# Altium schematic sheet Connectors.SchDoc
size A3
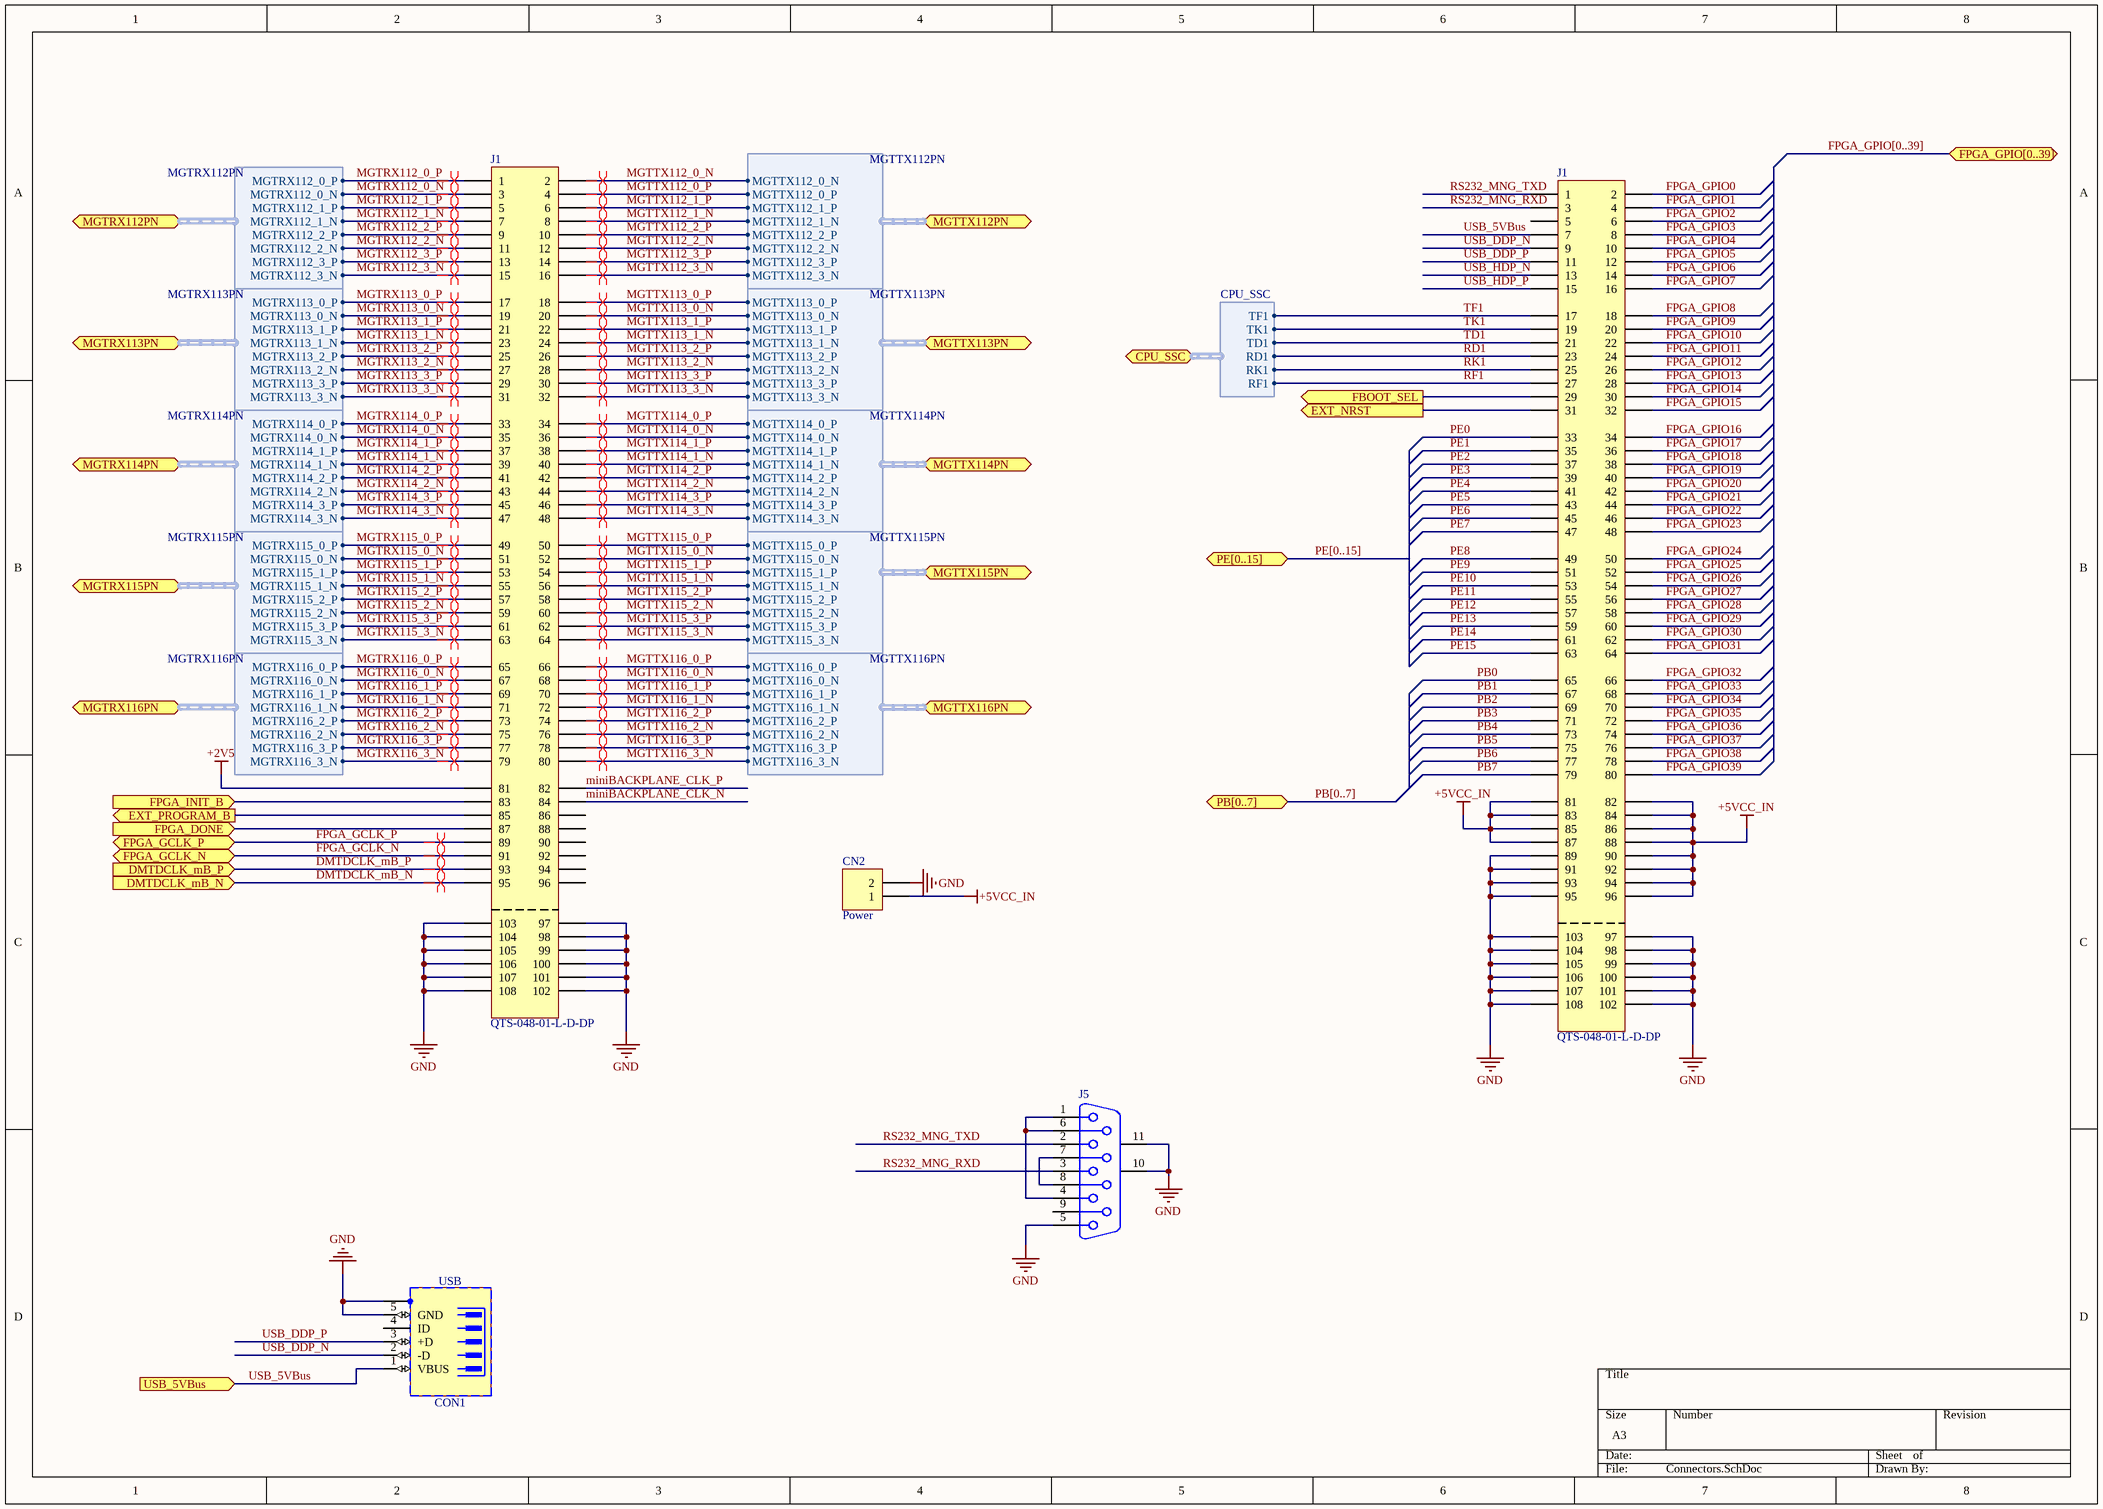
[diagram p0: Connectors.SchDoc]

## Parts
(Parts that share a designator on the sheet are numbered #1, #2 ... from top to bottom, then left to right.)
CN2  Power
CON1  USB  [TYCO_1734035-1]
J1#1  QTS-048-01-L-D-DP  [QTS-048-XX-X-D-DP-A]
J1#2  QTS-048-01-L-D-DP  [QTS-048-XX-X-D-DP-A]
J5  D Connector 9  [DSUB1.385-2H9]  (value not drawn)

## Ports
CPU_SSC (harness CPU_SSC), DMTDCLK_mB_N (in), DMTDCLK_mB_P (in), EXT_NRST (out), EXT_PROGRAM_B (out), FBOOT_SEL (out), FPGA_DONE (in), FPGA_GCLK_N (bidir), FPGA_GCLK_P (bidir), FPGA_GPIO[0..39] (bidir), FPGA_INIT_B (in), MGTRX112PN (harness MGTRX112PN), MGTRX113PN (harness MGTRX113PN), MGTRX114PN (harness MGTRX114PN), MGTRX115PN (harness MGTRX115PN), MGTRX116PN (harness MGTRX116PN), MGTTX112PN (harness MGTTX112PN), MGTTX113PN (harness MGTTX113PN), MGTTX114PN (harness MGTTX114PN), MGTTX115PN (harness MGTTX115PN), MGTTX116PN (harness MGTTX116PN), PB[0..7] (bidir), PE[0..15] (bidir), USB_5VBus (in)

## Harnesses
MGTTX112PN: MGTTX112_0_P, MGTTX112_0_N, MGTTX112_1_P, MGTTX112_1_N, MGTTX112_2_P, MGTTX112_2_N, MGTTX112_3_P, MGTTX112_3_N
MGTTX113PN: MGTTX113_0_P, MGTTX113_0_N, MGTTX113_1_P, MGTTX113_1_N, MGTTX113_2_P, MGTTX113_2_N, MGTTX113_3_P, MGTTX113_3_N
MGTTX114PN: MGTTX114_0_P, MGTTX114_0_N, MGTTX114_1_P, MGTTX114_1_N, MGTTX114_2_P, MGTTX114_2_N, MGTTX114_3_P, MGTTX114_3_N
MGTTX115PN: MGTTX115_0_P, MGTTX115_0_N, MGTTX115_1_P, MGTTX115_1_N, MGTTX115_2_P, MGTTX115_2_N, MGTTX115_3_P, MGTTX115_3_N
MGTTX116PN: MGTTX116_0_P, MGTTX116_0_N, MGTTX116_1_P, MGTTX116_1_N, MGTTX116_2_P, MGTTX116_2_N, MGTTX116_3_P, MGTTX116_3_N
MGTRX112PN: MGTRX112_0_P, MGTRX112_0_N, MGTRX112_1_P, MGTRX112_1_N, MGTRX112_2_P, MGTRX112_2_N, MGTRX112_3_P, MGTRX112_3_N
MGTRX113PN: MGTRX113_0_P, MGTRX113_0_N, MGTRX113_1_P, MGTRX113_1_N, MGTRX113_2_P, MGTRX113_2_N, MGTRX113_3_P, MGTRX113_3_N
MGTRX114PN: MGTRX114_0_P, MGTRX114_0_N, MGTRX114_1_P, MGTRX114_1_N, MGTRX114_2_P, MGTRX114_2_N, MGTRX114_3_P, MGTRX114_3_N
MGTRX115PN: MGTRX115_0_P, MGTRX115_0_N, MGTRX115_1_P, MGTRX115_1_N, MGTRX115_2_P, MGTRX115_2_N, MGTRX115_3_P, MGTRX115_3_N
MGTRX116PN: MGTRX116_0_P, MGTRX116_0_N, MGTRX116_1_P, MGTRX116_1_N, MGTRX116_2_P, MGTRX116_2_N, MGTRX116_3_P, MGTRX116_3_N
CPU_SSC: TF1, TK1, TD1, RD1, RK1, RF1

## Nets
+2V5: J1#1.81
+5VCC_IN: CN2.1 J1#2.81 J1#2.82 J1#2.83 J1#2.84 J1#2.85 J1#2.86 J1#2.87 J1#2.88 J1#2.90 J1#2.92 J1#2.94 J1#2.96
GND: CN2.2 CON1.5(GND) CON1.6(SH) J1#1.97 J1#1.98 J1#1.99 J1#1.100 J1#1.101 J1#1.102 J1#1.103 J1#1.104 J1#1.105 J1#1.106 J1#1.107 J1#1.108 J1#2.89 J1#2.91 J1#2.93 J1#2.95 J1#2.97 J1#2.98 J1#2.99 J1#2.100 J1#2.101 J1#2.102 J1#2.103 J1#2.104 J1#2.105 J1#2.106 J1#2.107 J1#2.108 J5.5 J5.10(MH1) J5.11(MH2)
DMTDCLK_mB_N: J1#1.95 ; port DMTDCLK_mB_N
DMTDCLK_mB_P: J1#1.93 ; port DMTDCLK_mB_P
EXT_NRST: J1#2.31 ; port EXT_NRST
EXT_PROGRAM_B: J1#1.85 ; port EXT_PROGRAM_B
FBOOT_SEL: J1#2.29 ; port FBOOT_SEL
FPGA_DONE: J1#1.87 ; port FPGA_DONE
FPGA_GCLK_N: J1#1.91 ; port FPGA_GCLK_N
FPGA_GCLK_P: J1#1.89 ; port FPGA_GCLK_P
FPGA_GPIO0: J1#2.2
FPGA_GPIO1: J1#2.4
FPGA_GPIO2: J1#2.6
FPGA_GPIO3: J1#2.8
FPGA_GPIO4: J1#2.10
FPGA_GPIO5: J1#2.12
FPGA_GPIO6: J1#2.14
FPGA_GPIO7: J1#2.16
FPGA_GPIO8: J1#2.18
FPGA_GPIO9: J1#2.20
FPGA_GPIO10: J1#2.22
FPGA_GPIO11: J1#2.24
FPGA_GPIO12: J1#2.26
FPGA_GPIO13: J1#2.28
FPGA_GPIO14: J1#2.30
FPGA_GPIO15: J1#2.32
FPGA_GPIO16: J1#2.34
FPGA_GPIO17: J1#2.36
FPGA_GPIO18: J1#2.38
FPGA_GPIO19: J1#2.40
FPGA_GPIO20: J1#2.42
FPGA_GPIO21: J1#2.44
FPGA_GPIO22: J1#2.46
FPGA_GPIO23: J1#2.48
FPGA_GPIO24: J1#2.50
FPGA_GPIO25: J1#2.52
FPGA_GPIO26: J1#2.54
FPGA_GPIO27: J1#2.56
FPGA_GPIO28: J1#2.58
FPGA_GPIO29: J1#2.60
FPGA_GPIO30: J1#2.62
FPGA_GPIO31: J1#2.64
FPGA_GPIO32: J1#2.66
FPGA_GPIO33: J1#2.68
FPGA_GPIO34: J1#2.70
FPGA_GPIO35: J1#2.72
FPGA_GPIO36: J1#2.74
FPGA_GPIO37: J1#2.76
FPGA_GPIO38: J1#2.78
FPGA_GPIO39: J1#2.80
FPGA_INIT_B: J1#1.83 ; port FPGA_INIT_B
MGTRX112_0_N: J1#1.3 ; port MGTRX112PN.MGTRX112_0_N
MGTRX112_0_P: J1#1.1 ; port MGTRX112PN.MGTRX112_0_P
MGTRX112_1_N: J1#1.7 ; port MGTRX112PN.MGTRX112_1_N
MGTRX112_1_P: J1#1.5 ; port MGTRX112PN.MGTRX112_1_P
MGTRX112_2_N: J1#1.11 ; port MGTRX112PN.MGTRX112_2_N
MGTRX112_2_P: J1#1.9 ; port MGTRX112PN.MGTRX112_2_P
MGTRX112_3_N: J1#1.15 ; port MGTRX112PN.MGTRX112_3_N
MGTRX112_3_P: J1#1.13 ; port MGTRX112PN.MGTRX112_3_P
MGTRX113_0_N: J1#1.19 ; port MGTRX113PN.MGTRX113_0_N
MGTRX113_0_P: J1#1.17 ; port MGTRX113PN.MGTRX113_0_P
MGTRX113_1_N: J1#1.23 ; port MGTRX113PN.MGTRX113_1_N
MGTRX113_1_P: J1#1.21 ; port MGTRX113PN.MGTRX113_1_P
MGTRX113_2_N: J1#1.27 ; port MGTRX113PN.MGTRX113_2_N
MGTRX113_2_P: J1#1.25 ; port MGTRX113PN.MGTRX113_2_P
MGTRX113_3_N: J1#1.31 ; port MGTRX113PN.MGTRX113_3_N
MGTRX113_3_P: J1#1.29 ; port MGTRX113PN.MGTRX113_3_P
MGTRX114_0_N: J1#1.35 ; port MGTRX114PN.MGTRX114_0_N
MGTRX114_0_P: J1#1.33 ; port MGTRX114PN.MGTRX114_0_P
MGTRX114_1_N: J1#1.39 ; port MGTRX114PN.MGTRX114_1_N
MGTRX114_1_P: J1#1.37 ; port MGTRX114PN.MGTRX114_1_P
MGTRX114_2_N: J1#1.43 ; port MGTRX114PN.MGTRX114_2_N
MGTRX114_2_P: J1#1.41 ; port MGTRX114PN.MGTRX114_2_P
MGTRX114_3_N: J1#1.47 ; port MGTRX114PN.MGTRX114_3_N
MGTRX114_3_P: J1#1.45 ; port MGTRX114PN.MGTRX114_3_P
MGTRX115_0_N: J1#1.51 ; port MGTRX115PN.MGTRX115_0_N
MGTRX115_0_P: J1#1.49 ; port MGTRX115PN.MGTRX115_0_P
MGTRX115_1_N: J1#1.55 ; port MGTRX115PN.MGTRX115_1_N
MGTRX115_1_P: J1#1.53 ; port MGTRX115PN.MGTRX115_1_P
MGTRX115_2_N: J1#1.59 ; port MGTRX115PN.MGTRX115_2_N
MGTRX115_2_P: J1#1.57 ; port MGTRX115PN.MGTRX115_2_P
MGTRX115_3_N: J1#1.63 ; port MGTRX115PN.MGTRX115_3_N
MGTRX115_3_P: J1#1.61 ; port MGTRX115PN.MGTRX115_3_P
MGTRX116_0_N: J1#1.67 ; port MGTRX116PN.MGTRX116_0_N
MGTRX116_0_P: J1#1.65 ; port MGTRX116PN.MGTRX116_0_P
MGTRX116_1_N: J1#1.71 ; port MGTRX116PN.MGTRX116_1_N
MGTRX116_1_P: J1#1.69 ; port MGTRX116PN.MGTRX116_1_P
MGTRX116_2_N: J1#1.75 ; port MGTRX116PN.MGTRX116_2_N
MGTRX116_2_P: J1#1.73 ; port MGTRX116PN.MGTRX116_2_P
MGTRX116_3_N: J1#1.79 ; port MGTRX116PN.MGTRX116_3_N
MGTRX116_3_P: J1#1.77 ; port MGTRX116PN.MGTRX116_3_P
MGTTX112_0_N: J1#1.2 ; port MGTTX112PN.MGTTX112_0_N
MGTTX112_0_P: J1#1.4 ; port MGTTX112PN.MGTTX112_0_P
MGTTX112_1_N: J1#1.8 ; port MGTTX112PN.MGTTX112_1_N
MGTTX112_1_P: J1#1.6 ; port MGTTX112PN.MGTTX112_1_P
MGTTX112_2_N: J1#1.12 ; port MGTTX112PN.MGTTX112_2_N
MGTTX112_2_P: J1#1.10 ; port MGTTX112PN.MGTTX112_2_P
MGTTX112_3_N: J1#1.16 ; port MGTTX112PN.MGTTX112_3_N
MGTTX112_3_P: J1#1.14 ; port MGTTX112PN.MGTTX112_3_P
MGTTX113_0_N: J1#1.20 ; port MGTTX113PN.MGTTX113_0_N
MGTTX113_0_P: J1#1.18 ; port MGTTX113PN.MGTTX113_0_P
MGTTX113_1_N: J1#1.24 ; port MGTTX113PN.MGTTX113_1_N
MGTTX113_1_P: J1#1.22 ; port MGTTX113PN.MGTTX113_1_P
MGTTX113_2_N: J1#1.28 ; port MGTTX113PN.MGTTX113_2_N
MGTTX113_2_P: J1#1.26 ; port MGTTX113PN.MGTTX113_2_P
MGTTX113_3_N: J1#1.32 ; port MGTTX113PN.MGTTX113_3_N
MGTTX113_3_P: J1#1.30 ; port MGTTX113PN.MGTTX113_3_P
MGTTX114_0_N: J1#1.36 ; port MGTTX114PN.MGTTX114_0_N
MGTTX114_0_P: J1#1.34 ; port MGTTX114PN.MGTTX114_0_P
MGTTX114_1_N: J1#1.40 ; port MGTTX114PN.MGTTX114_1_N
MGTTX114_1_P: J1#1.38 ; port MGTTX114PN.MGTTX114_1_P
MGTTX114_2_N: J1#1.44 ; port MGTTX114PN.MGTTX114_2_N
MGTTX114_2_P: J1#1.42 ; port MGTTX114PN.MGTTX114_2_P
MGTTX114_3_N: J1#1.48 ; port MGTTX114PN.MGTTX114_3_N
MGTTX114_3_P: J1#1.46 ; port MGTTX114PN.MGTTX114_3_P
MGTTX115_0_N: J1#1.52 ; port MGTTX115PN.MGTTX115_0_N
MGTTX115_0_P: J1#1.50 ; port MGTTX115PN.MGTTX115_0_P
MGTTX115_1_N: J1#1.56 ; port MGTTX115PN.MGTTX115_1_N
MGTTX115_1_P: J1#1.54 ; port MGTTX115PN.MGTTX115_1_P
MGTTX115_2_N: J1#1.60 ; port MGTTX115PN.MGTTX115_2_N
MGTTX115_2_P: J1#1.58 ; port MGTTX115PN.MGTTX115_2_P
MGTTX115_3_N: J1#1.64 ; port MGTTX115PN.MGTTX115_3_N
MGTTX115_3_P: J1#1.62 ; port MGTTX115PN.MGTTX115_3_P
MGTTX116_0_N: J1#1.68 ; port MGTTX116PN.MGTTX116_0_N
MGTTX116_0_P: J1#1.66 ; port MGTTX116PN.MGTTX116_0_P
MGTTX116_1_N: J1#1.72 ; port MGTTX116PN.MGTTX116_1_N
MGTTX116_1_P: J1#1.70 ; port MGTTX116PN.MGTTX116_1_P
MGTTX116_2_N: J1#1.76 ; port MGTTX116PN.MGTTX116_2_N
MGTTX116_2_P: J1#1.74 ; port MGTTX116PN.MGTTX116_2_P
MGTTX116_3_N: J1#1.80 ; port MGTTX116PN.MGTTX116_3_N
MGTTX116_3_P: J1#1.78 ; port MGTTX116PN.MGTTX116_3_P
miniBACKPLANE_CLK_N: J1#1.84
miniBACKPLANE_CLK_P: J1#1.82
PB0: J1#2.65
PB1: J1#2.67
PB2: J1#2.69
PB3: J1#2.71
PB4: J1#2.73
PB5: J1#2.75
PB6: J1#2.77
PB7: J1#2.79
PE0: J1#2.33
PE1: J1#2.35
PE2: J1#2.37
PE3: J1#2.39
PE4: J1#2.41
PE5: J1#2.43
PE6: J1#2.45
PE7: J1#2.47
PE8: J1#2.49
PE9: J1#2.51
PE10: J1#2.53
PE11: J1#2.55
PE12: J1#2.57
PE13: J1#2.59
PE14: J1#2.61
PE15: J1#2.63
RD1: J1#2.23 ; port CPU_SSC.RD1
RF1: J1#2.27 ; port CPU_SSC.RF1
RK1: J1#2.25 ; port CPU_SSC.RK1
RS232_MNG_RXD: J1#2.3 J5.3
RS232_MNG_TXD: J1#2.1 J5.2
TD1: J1#2.21 ; port CPU_SSC.TD1
TF1: J1#2.17 ; port CPU_SSC.TF1
TK1: J1#2.19 ; port CPU_SSC.TK1
USB_5VBus: CON1.1(VBUS) J1#2.7 ; port USB_5VBus
USB_DDP_N: CON1.2(-D) J1#2.9
USB_DDP_P: CON1.3(+D) J1#2.11
USB_HDP_N: J1#2.13
USB_HDP_P: J1#2.15
NetJ5_1: J5.1 J5.4 J5.6
NetJ5_7: J5.7 J5.8

Not connected (* = marked no-connect by the designer): CON1 4(ID); J1#1 86 88 90 92 94 96; J1#2 5; J5 9

## Buses and harness runs
bus FPGA_GPIO[0..39] = port FPGA_GPIO[0..39]
bus PB[0..7] = port PB[0..7]
bus PE[0..15] = port PE[0..15]

## Layout directives
differential pair: DMTDCLK_mB_N, DMTDCLK_mB_P, FPGA_GCLK_N, FPGA_GCLK_P, MGTRX112_0_N, MGTRX112_0_P, MGTRX112_1_N, MGTRX112_1_P, MGTRX112_2_N, MGTRX112_2_P, MGTRX112_3_N, MGTRX112_3_P, MGTRX113_0_N, MGTRX113_0_P, MGTRX113_1_N, MGTRX113_1_P, MGTRX113_2_N, MGTRX113_2_P, MGTRX113_3_N, MGTRX113_3_P, MGTRX114_0_N, MGTRX114_0_P, MGTRX114_1_N, MGTRX114_1_P, MGTRX114_2_N, MGTRX114_2_P, MGTRX114_3_N, MGTRX114_3_P, MGTRX115_0_N, MGTRX115_0_P, MGTRX115_1_N, MGTRX115_1_P, MGTRX115_2_N, MGTRX115_2_P, MGTRX115_3_N, MGTRX115_3_P, MGTRX116_0_N, MGTRX116_0_P, MGTRX116_1_N, MGTRX116_1_P, MGTRX116_2_N, MGTRX116_2_P, MGTRX116_3_N, MGTRX116_3_P, MGTTX112_0_N, MGTTX112_0_P, MGTTX112_1_N, MGTTX112_1_P, MGTTX112_2_N, MGTTX112_2_P, MGTTX112_3_N, MGTTX112_3_P, MGTTX113_0_N, MGTTX113_0_P, MGTTX113_1_N, MGTTX113_1_P, MGTTX113_2_N, MGTTX113_2_P, MGTTX113_3_N, MGTTX113_3_P, MGTTX114_0_N, MGTTX114_0_P, MGTTX114_1_N, MGTTX114_1_P, MGTTX114_2_N, MGTTX114_2_P, MGTTX114_3_N, MGTTX114_3_P, MGTTX115_0_N, MGTTX115_0_P, MGTTX115_1_N, MGTTX115_1_P, MGTTX115_2_N, MGTTX115_2_P, MGTTX115_3_N, MGTTX115_3_P, MGTTX116_0_N, MGTTX116_0_P, MGTTX116_1_N, MGTTX116_1_P, MGTTX116_2_N, MGTTX116_2_P, MGTTX116_3_N, MGTTX116_3_P

## Library data of the parts
CN2 = Header 2: Header, 2-Pin; Manufacturer1 PN: 794120-1; Manufacturer1: Tyco Electronics; LatestRevisionDate: 17-Jul-2002; LatestRevisionNote: Re-released for DXP Platform.; Publisher: Altium Limited; Distributor1: Digikey; Distributor1 PN: A25753-ND
CON1 = TYCO_1734035-1: 5 Pin + 1 Shield USB Receptacle; Part Description: 5 Position, Right Angle, SMD Mini USB Type B Receptacle; Manufacturer: TYCO ELECTRONICS; Table: TYCO; Part Number: TYCO_1734035-1; Component Kind: Standard; Component Type: Standard; Pin Count: 6; Family: USB; Mounted: Yes; Socket: No; SMD: Yes; Status: None; Manufacturer Part Number: 1734035-1; ComponentHeight: 3.95mm; HelpURL: \\cern.ch\dfs\Applications\Altium\Datasheets\TYCO_1734035-1.pdf; Author: CERN DEM JLC; CreateDate: 5/2/2011; LatestRevisionDate: 5/2/2011
J1#1 J1#2 = QTS-048-01-L-D-DP: High Speed Ground Plane Header; Manufacturer1: Samtec; Manufacturer1 PN: QTS-048-01-L-D-DP
J5 = D Connector 9: Receptacle Assembly, 9 Position, Right Angle; Manufacturer1 PN: 1734348-1; Manufacturer1: TE Connectivity; PackageDocument: O; Positions: 9; Published: 15-Jun-2001; LatestRevisionDate: 17-Jul-2002; LatestRevisionNote: Re-released for DXP Platform.; DatasheetDocument: 1-Sep-1999; PackageReference: 788750; Publisher: Altium Limited; Orientation: Right Angle; Gender: Receptacle; Distributor1: Digikey; Distributor1 PN: A35109-ND